# Altium schematic sheet aux_power.SchDoc: AUX supply
size A4; Organization: GPA Robotics; DocumentNumber: 10; Revision: REV 0; SheetNumber: 10; SheetTotal: 11
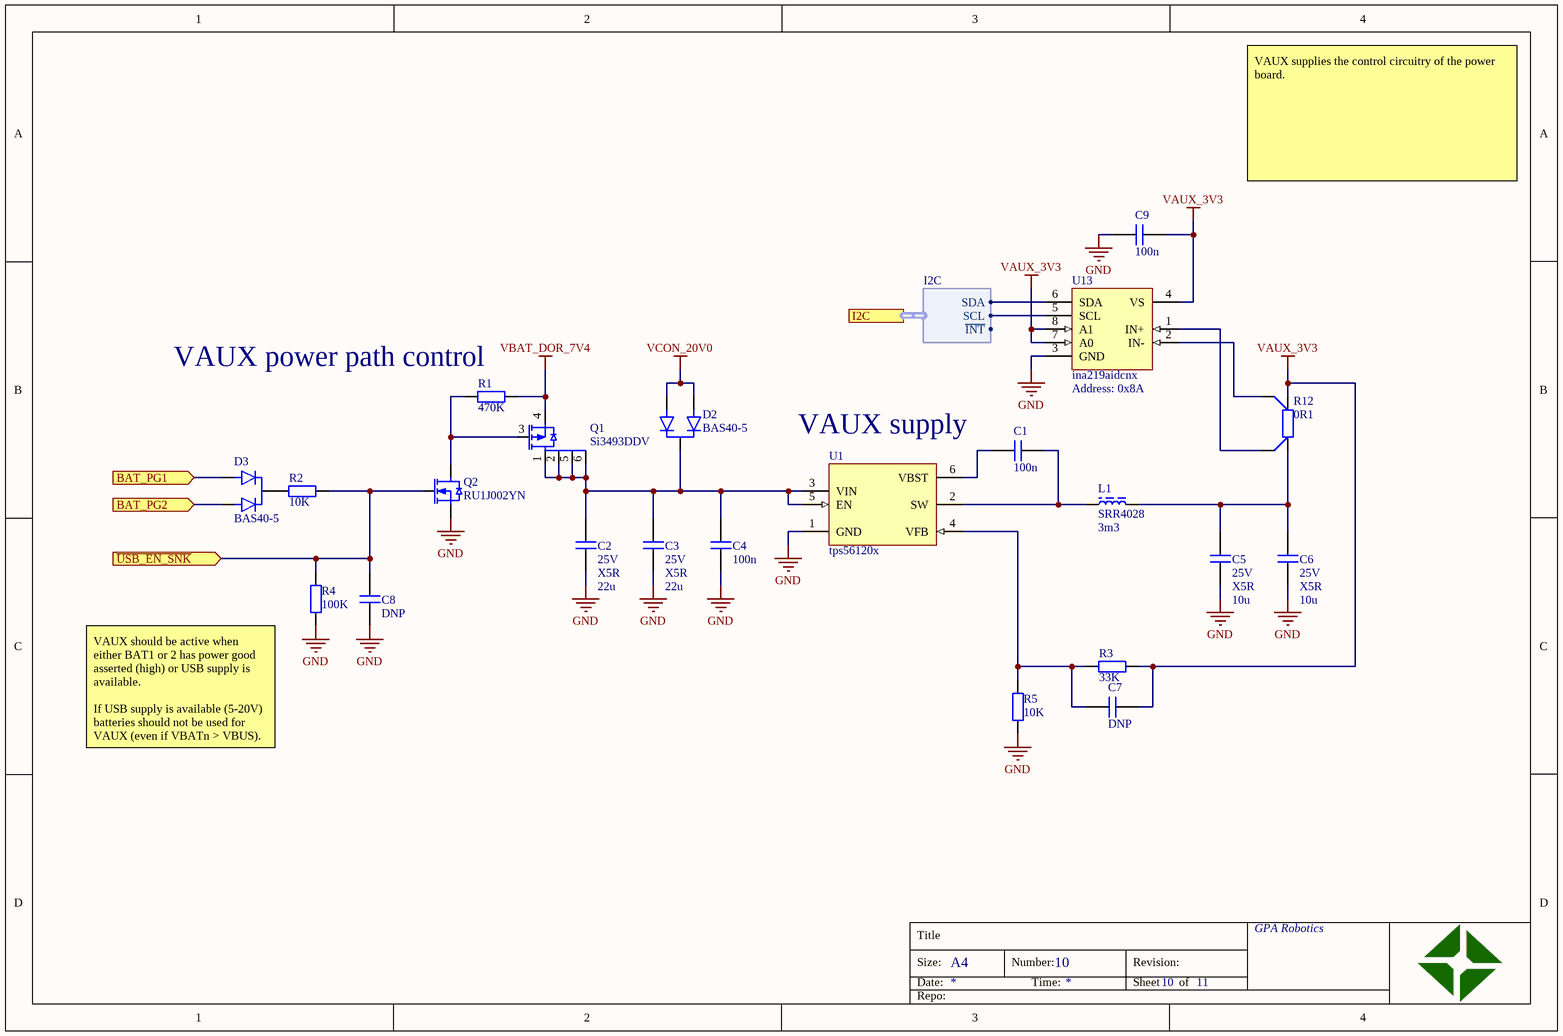
[diagram p0: aux_power.SchDoc]

## Parts
C1  value 100n  [CAPC1005X06N]  (hidden comment: cap)
C2  value 22u  voltage: 25V  type: X5R  [CAPC3216X14N]  (hidden comment: cap)
C3  value 22u  voltage: 25V  type: X5R  [CAPC3216X14N]  (hidden comment: cap)
C4  value 100n  [CAPC1005X06N]  (hidden comment: cap)
C5  value 10u  voltage: 25V  type: X5R  [CAPC3216X14N]  (hidden comment: cap)
C6  value 10u  voltage: 25V  type: X5R  [CAPC3216X14N]  (hidden comment: cap)
C7  value DNP  [CAPC1005X06N]  (hidden comment: cap)
C8  value DNP  [CAPC1005X06N]  (hidden comment: cap)
C9  value 100n  [CAPC1005X06N]  (hidden comment: cap)
D2  BAS40-5  [SOT23_CC]
D3  BAS40-5  [SOT23_CC]
L1  SRR4028  value 3m3  [SRR4028]
Q1  Si3493DDV  [SOT95P284X110-6N_TSOP6]
Q2  RU1J002YN  [SOTFL65P210X105-3N]
R1  value 470K  [RESC1005X04N]  (hidden comment: res)
R2  value 10K  [RESC1005X04N]  (hidden comment: res)
R3  value 33K  [RESC1005X04N]  (hidden comment: res)
R4  value 100K  [RESC1005X04N]  (hidden comment: res)
R5  value 10K  [RESC1005X04N]  (hidden comment: res)
R12  value 0R1  [RESC2012X06N_4T]  (hidden comment: res_4t)
U1  tps56120x  [SOT95P280X110-6N]
U13  ina219aidcnx  Address: 0x8A  [TSOP65P280X145-8N]

## Ports
BAT_PG1 (in), BAT_PG2 (in), I2C (harness I2C), ~{USB_EN_SNK} (in)

## Harnesses
I2C: SDA, SCL, ~{INT}

## Nets
GND: C2.1 C3.1 C4.1 C5.1 C6.1 C8.1 C9.2 Q2.2(S) R4.1 R5.1 U1.1(GND) U13.3(GND)
VAUX_3V3: C7.2 C9.1 R3.2 R12.1 U13.4(VS) U13.7(A0) U13.8(A1)
VBAT_DOR_7V4: Q1.4(S) R1.2
VCON_20V0: D2.A1 D2.A2
~{USB_EN_SNK}: C8.2 Q2.1(G) R2.2 R4.2 ; port ~{USB_EN_SNK}
BAT_PG1: D3.A1 ; port BAT_PG1
BAT_PG2: D3.A2 ; port BAT_PG2
NetC1_1: C1.1 U1.6(VBST)
NetC1_2: C1.2 L1.1 U1.2(SW)
NetC2_2: C2.2 C3.2 C4.2 D2.C Q1.1(D) Q1.2(D) Q1.5(D) Q1.6(D) U1.3(VIN) U1.5(EN)
NetC5_2: C5.2 C6.2 L1.2 R12.2
NetC7_1: C7.1 R3.1 R5.2 U1.4(VFB)
NetD3_C: D3.C R2.1
NetQ1_3: Q1.3(G) Q2.3(D) R1.1
NetR12_3: R12.3 U13.2(IN-)
NetR12_4: R12.4 U13.1(IN+)
NetU13_5: U13.5(SCL) ; port I2C.SCL
NetU13_6: U13.6(SDA) ; port I2C.SDA

## Notes on the sheet
- VAUX supplies the control circuitry of the power board.
- (near R1) VAUX power path control
- VAUX supply
- (near R4) VAUX should be active when either BAT1 or 2 has power good asserted (high) or USB supply is available.
  If USB supply is available (5-20V) batteries should not be used for VAUX (even if VBATn > VBUS).
- Title
- Size:
- Date:
- A4
- Number:
- Time:
- Revision:
- Sheet
- of
- Repo:

## Library data of the parts
C1-C9 = cap: Capacitor; #digikey: *; #mouser: *
  C1 C4 C7-C9: voltage: *; type: *
D2 D3 = diode_dual_cc: Diode Common Cathode
Q1 = si3493ddv: P-Channel 20 V (D-S) MOSFET; ComponentLink1Description: datasheet; ComponentLink1URL: http://www.vishay.com/docs/62839/si7149adp.pdf
Q2 = ru1j002yn: N-channel 50V 200mA Small signal MOSFET; ComponentLink1Description: datasheet; ComponentLink1URL: https://www.mouser.se/datasheet/2/348/ru1j002yn-e-1018335.pdf
R1-R5 = res: Resistor; power: *; voltage: *; #digikey: *; #mouser: *
R12 = res_4t: Resistor; power: *; #digikey: *; #mouser: *
U1 = tps56120x: 4.5-V to 17-V Input, 1-A Synchronous  Step-Down  Voltage  Regulator  in 6-Pin  SOT-23; #digikey: *; #mouser: *
U13 = ina219aidcnx: INA219 Zero-Drift, Bidirectional Current/Power Monitor With I2C Interface; ComponentLink1Description: Datasheet; ComponentLink1URL: https://www.ti.com/lit/ds/symlink/ina219.pdf?&ts=1589650364826; Supplier 1: Digi-Key; Supplier Part Number 1: 296-23770-1-ND
L1 = srr4028: ComponentLink1Description: series; ComponentLink1URL: https://www.bourns.com/docs/Product-Datasheets/SRR4028.pdf